# EasyEDA Pro project ProProject_Hauptplatine_ESP32.epro, schematic Arduino_fuer_LEDs_DCC_1.8.2

## Sheets
1 Arduino_fuer_LEDs_DCC_1.8.2_1
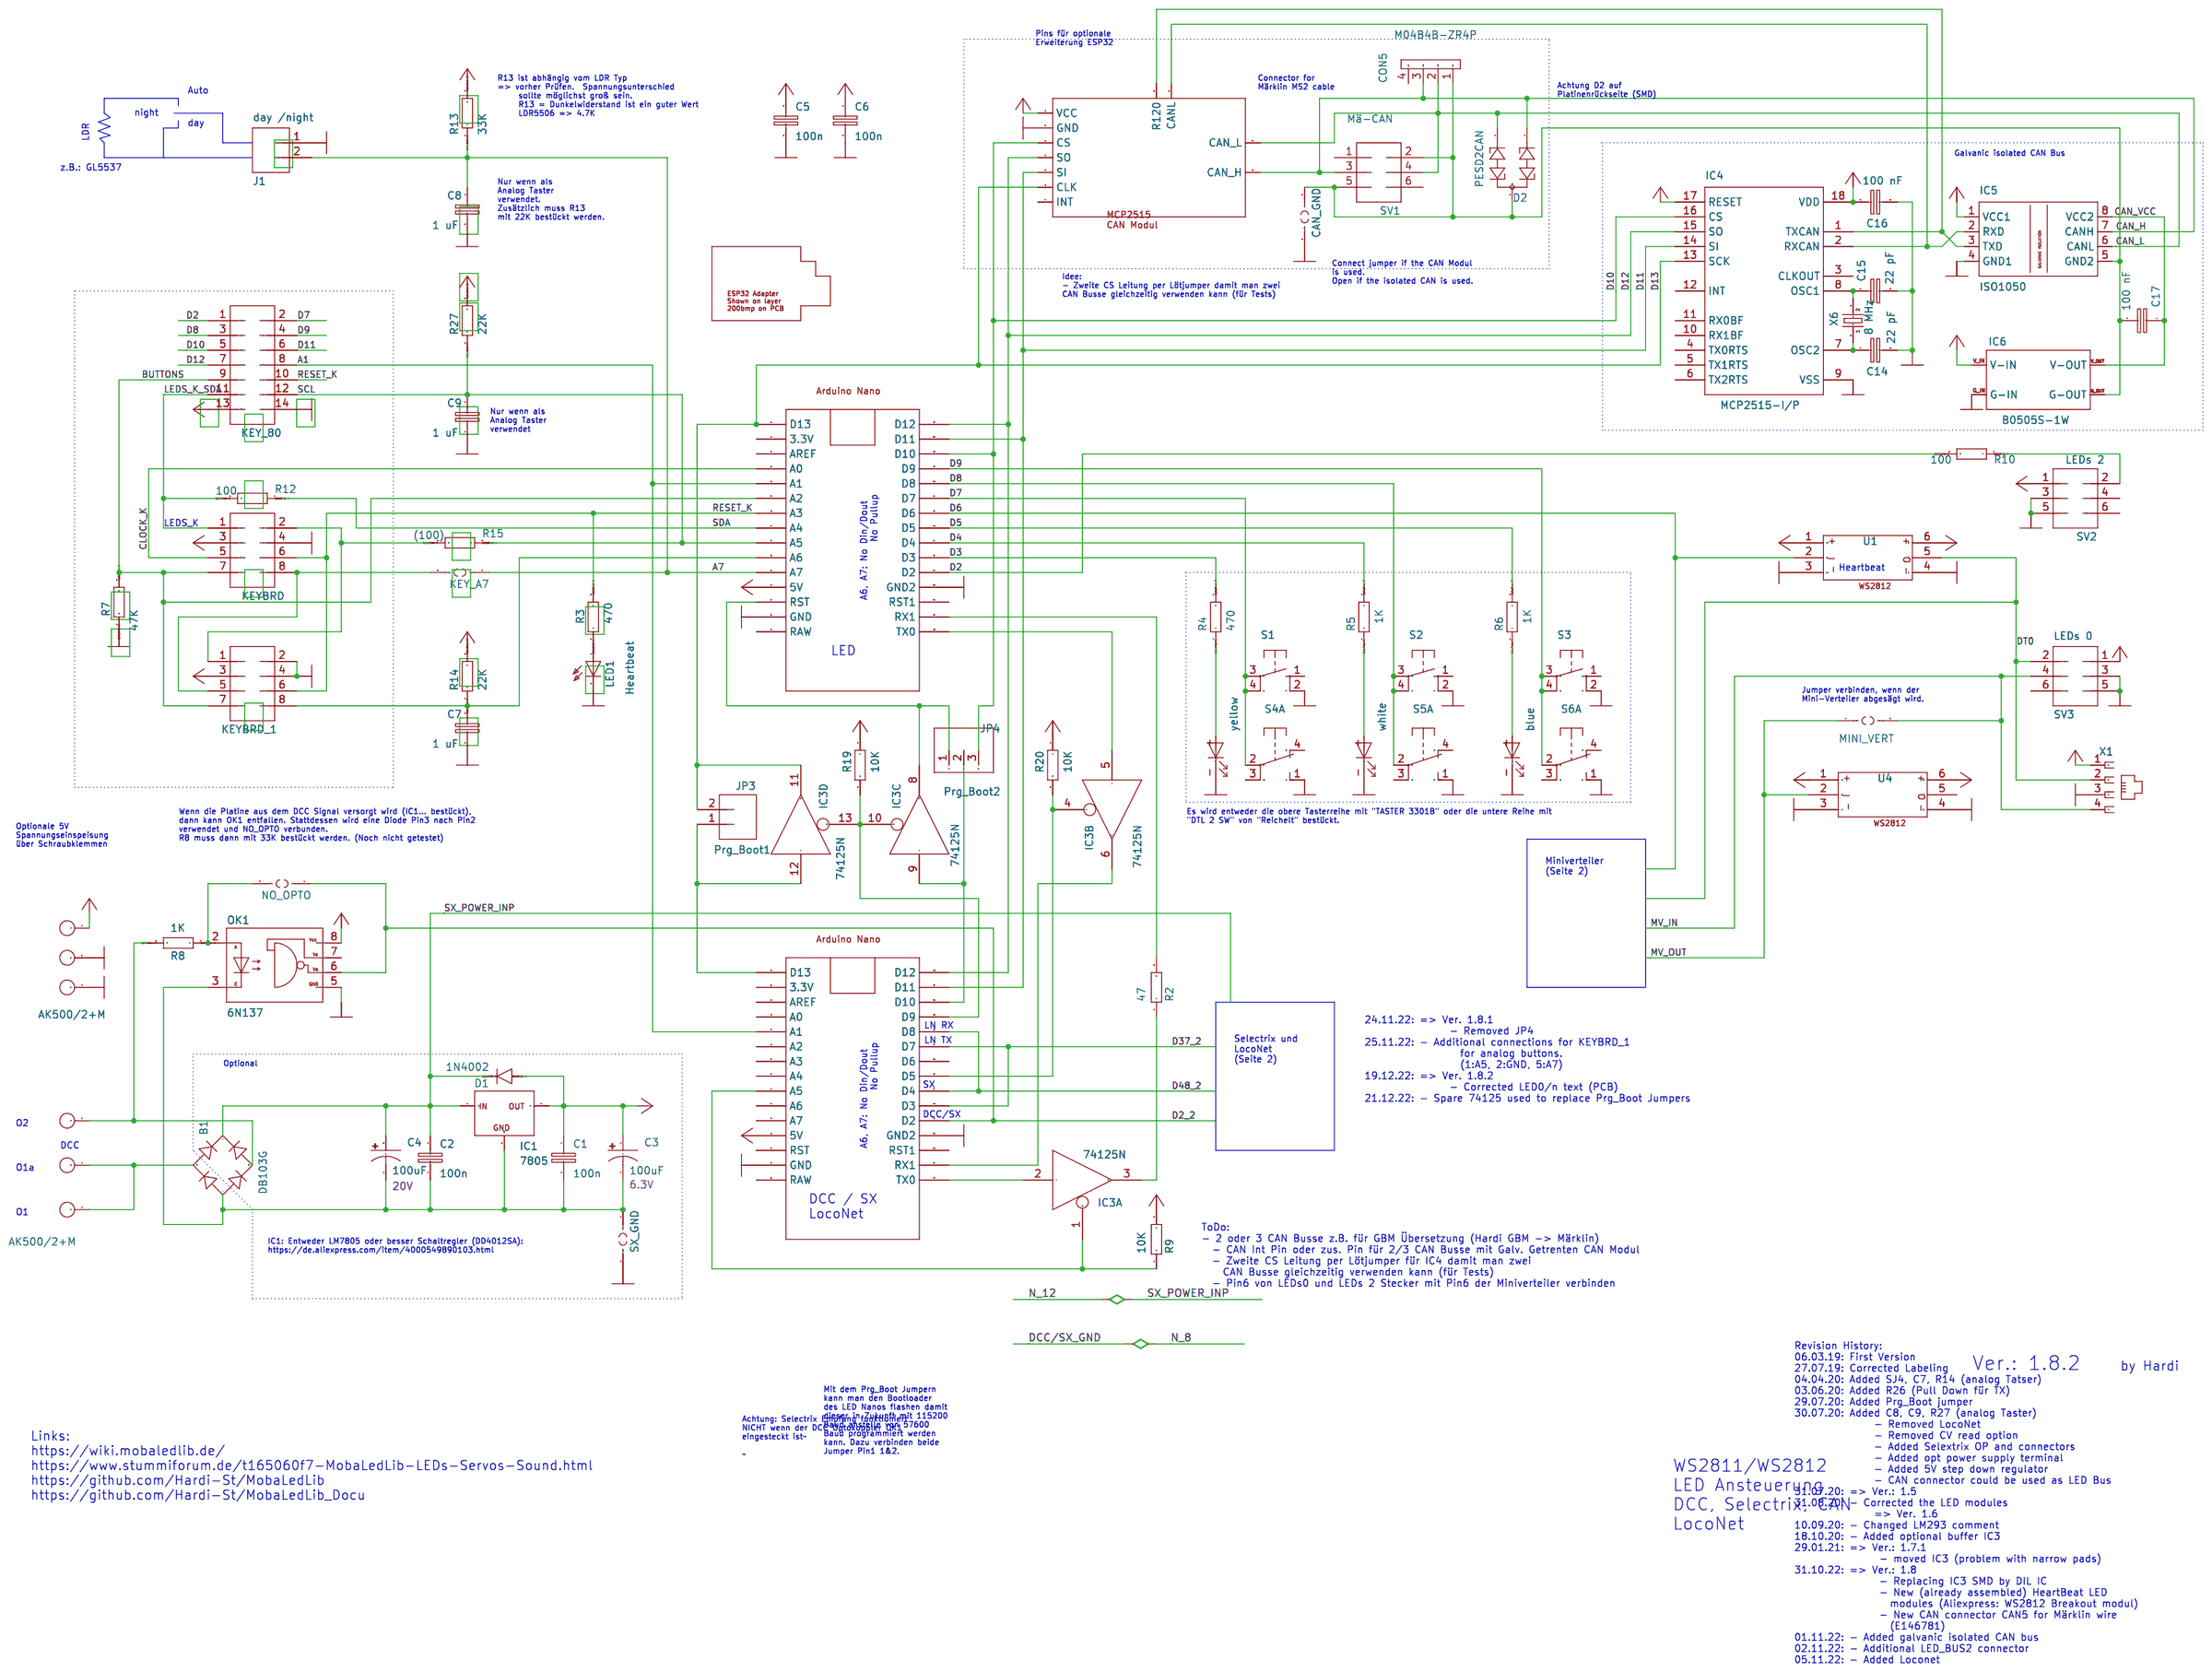
[diagram p3: Arduino_fuer_LEDs_DCC_1.8.2_1]
2 Arduino_fuer_LEDs_DCC_1.8.2_2
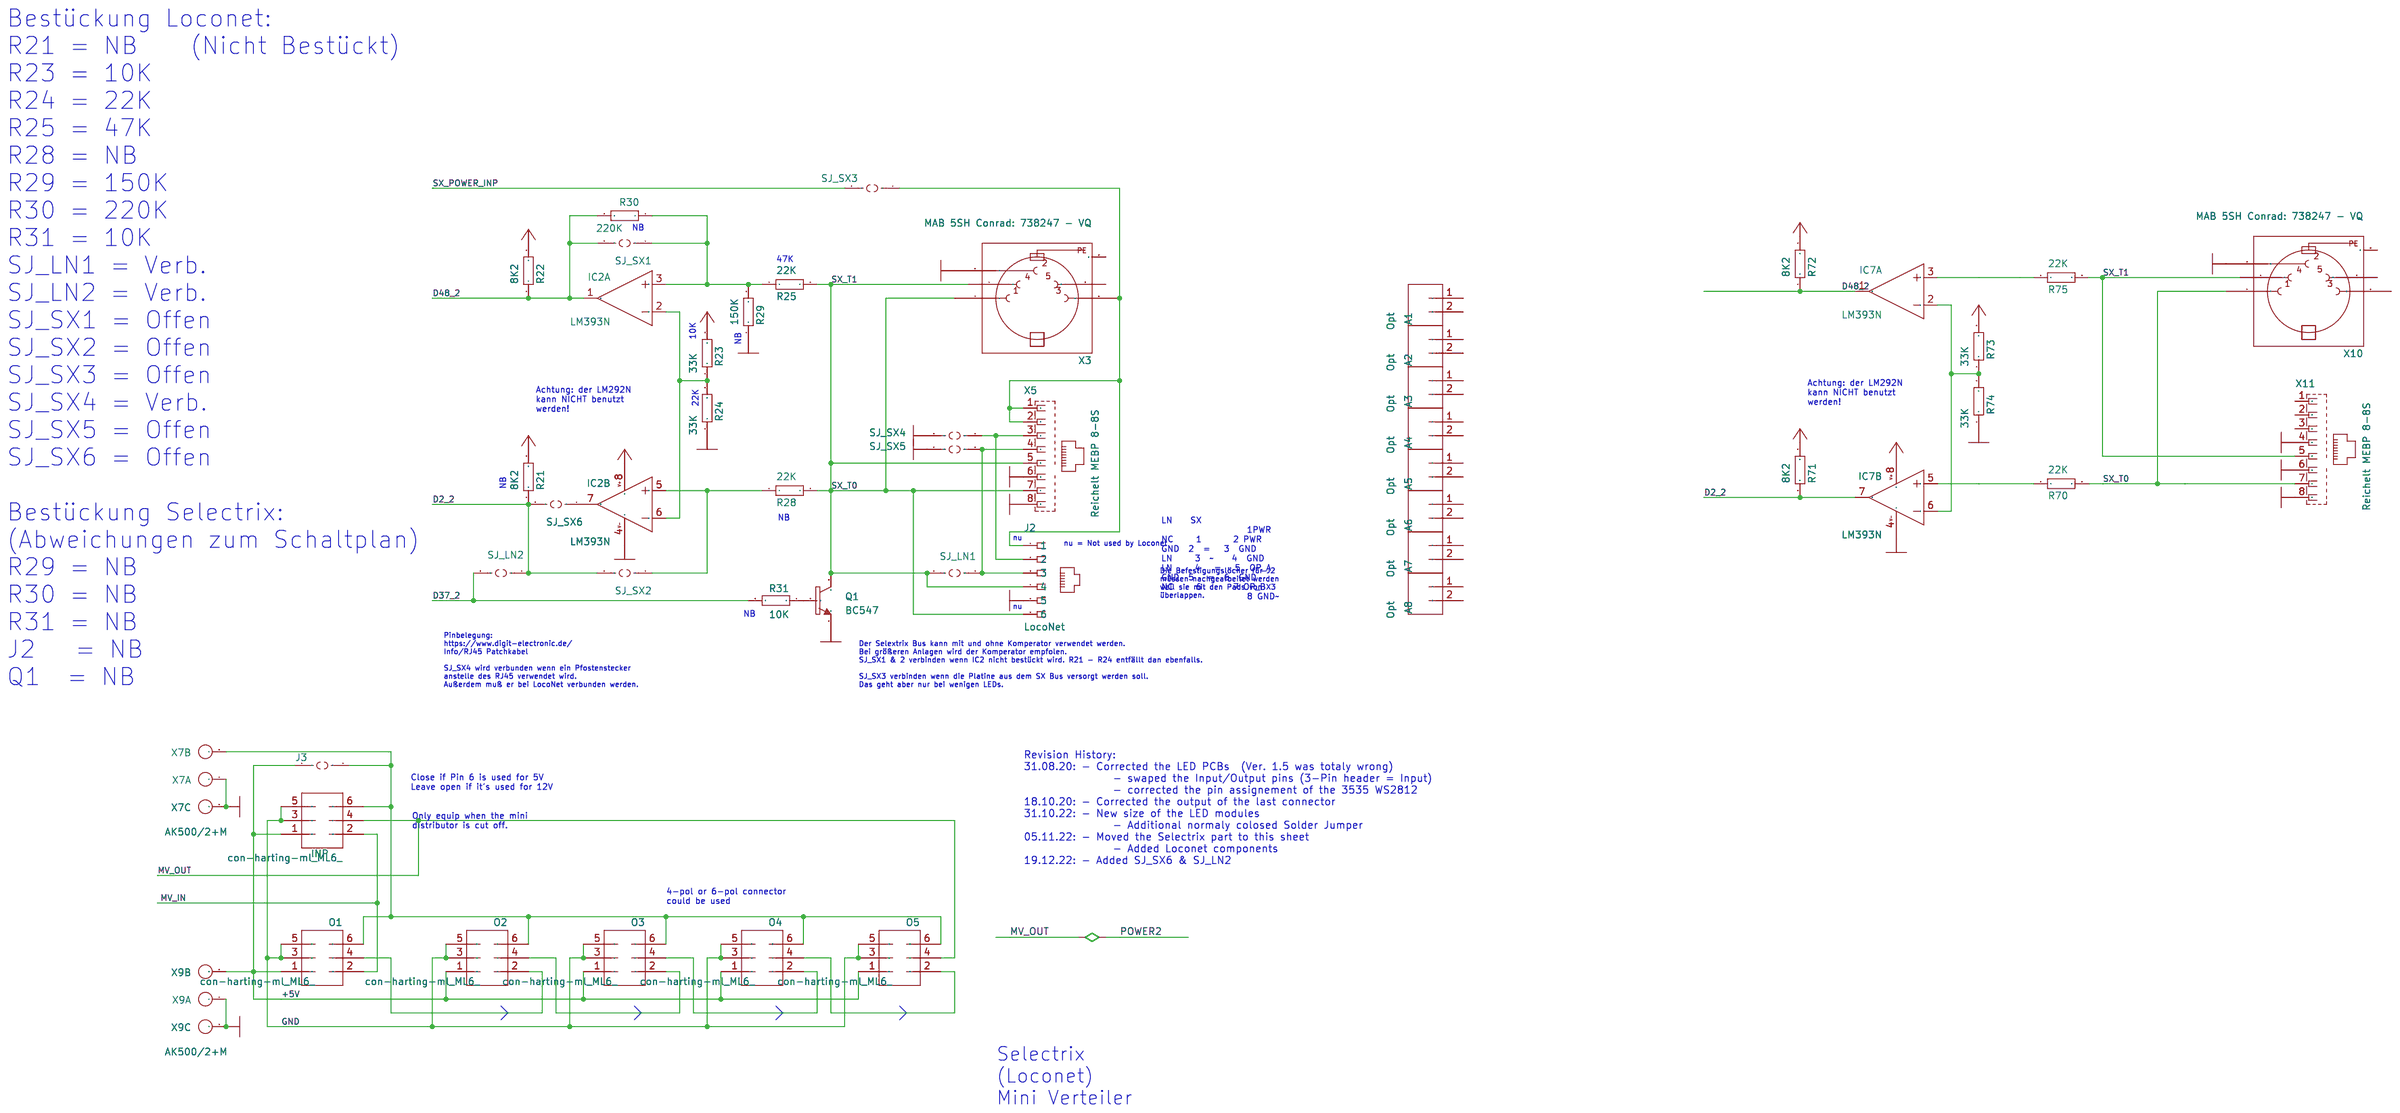
[diagram p4: Arduino_fuer_LEDs_DCC_1.8.2_2]

## Parts
sheet Arduino_fuer_LEDs_DCC_1.8.2_1
B1  DB103G
C1  100n
C2  100n
C3  100uF
C4  100uF
C5  100n
C6  100n
C7  1 uF
C8  1 uF
C9  1 uF
C14  22 pF
C15  22 pF
C16  100 nF
C17  100 nF
CAN2  MCP2515_CAN_MODUL
CAN_GND  SOLDERJUMPERNO
CON5  M04B4B-ZR4P
D1  1N4002
D2  PESD2CAN
IC1  7805
IC3  74125N  (sections A,B,C,D)
IC4  MCP2515-I/P
IC5  ISO1050
IC6  B0505S-1W
J1  day /night
JP3  Prg_Boot1
JP4  Prg_Boot2
KEY_80  ML14
KEY_A7  SOLDERJUMPERNO
KEYBRD  CON-HARTING-ML_ML08
KEYBRD_1  CON-HARTING-ML_ML08
LED1  Heartbeat
MINI_VERT  SOLDERJUMPERNO
NO_OPTO  SOLDERJUMPERNO
OK1  6N137
R2  47
R3  470
R4  470
R5  1K
R6  1K
R7  47K
R8  1K
R9  10K
R10  100
R12  100
R13  33K
R14  22K
R15  (100)
R19  10K
R20  10K
R27  22K
S1  10-XX
S2  10-XX
S3  10-XX
S4  yellow  (sections 1,D1)
S5  white  (sections 1,D1)
S6  blue  (sections 1,D1)
SV1  Mä-CAN
SV2  LEDs 2
SV3  LEDs 0
SX_GND  SOLDERJUMPERNO
U1  WS2812_BREAKOUT
U2  LED NANO
U3  DCC NANO
U4  WS2812_BREAKOUT
U$1  ESP_ADAPTER
X1  RJ10
X2  AK500/2+M  (sections G$1,G$2,G$3)
X4  AK500/2+M  (sections G$1,G$2,G$3)
X6  8 MHz
sheet Arduino_fuer_LEDs_DCC_1.8.2_2
A1  Opt
A2  Opt
A3  Opt
A4  Opt
A5  Opt
A6  Opt
A7  Opt
A8  Opt
IC2  LM393N  (sections A,B,P)
IC7  LM393N  (sections A,B,P)
INP  con-harting-ml_ML6_
J2  LocoNet
J3  SOLDERJUMPERNO
O1  con-harting-ml_ML6_
O2  con-harting-ml_ML6_
O3  con-harting-ml_ML6_
O4  con-harting-ml_ML6_
O5  con-harting-ml_ML6_
Q1  BC547
R21  8K2
R22  8K2
R23  33K
R24  33K
R25  22K
R28  22K
R29  150K
R30  220K
R31  10K
R70  22K
R71  8K2
R72  8K2
R73  33K
R74  33K
R75  22K
SJ_LN1  SOLDERJUMPERNO
SJ_LN2  SOLDERJUMPERNO
SJ_SX1  SOLDERJUMPERNO
SJ_SX2  SOLDERJUMPERNO
SJ_SX3  SOLDERJUMPERNO
SJ_SX4  SOLDERJUMPERNO
SJ_SX5  SOLDERJUMPERNO
SJ_SX6  SOLDERJUMPERNO
X3  MAB 5SH Conrad: 738247 - VQ
X5  Reichelt MEBP 8-8S
X7  AK500/2+M  (sections G$1,G$2,G$3)
X9  AK500/2+M  (sections G$1,G$2,G$3)
X10  MAB 5SH Conrad: 738247 - VQ
X11  Reichelt MEBP 8-8S

## Library data of the parts
B1 = Arduino_fuer_LEDs_DCC_2_DB?*G_DB10
C1 C2 C5-C9 = rcl_C-EU_025-025X050
C3 = Sound_MP3-TF-16P_and_WS2811_SPARKFUN-CAPACITORS_100UF-25V-20%(PTH)_: VOLTAGE: 6.3V
C4 = Sound_MP3-TF-16P_and_WS2811_SPARKFUN-CAPACITORS_100UF-25V-20%(PTH)_: VOLTAGE: 20V
C14-C17 = capacitor-wima_C_2.5/2
CAN2 = Arduino_fuer_LEDs_DCC_2_All_MCP2515_CAN_MODUL_
CAN_GND J3 KEY_A7 MINI_VERT NO_OPTO SJ_LN1 SJ_LN2 SJ_SX1-SJ_SX6 SX_GND = SparkFun-Retired_SOLDERJUMPER_NO
CON5 = Connectors_Inline3_7_M04_B4B-ZR4P
D1 = diode_1N4004_
D2 = diode_PESD1CAN_
IC1 = v-reg_78XXS_
IC3 = 74xx-us_74*125_N
IC4 = mcp2515_MCP2515_-I/P
IC5 = texas_ISO1050_
IC6 = MLL-Dominik-Hardi_DCDC_
A1-A8 J1 JP3 = SparkFun-Connectors_M02_PTH
JP4 = adafruit_PINHD-1X3_CB
KEY_80 = Arduino_fuer_LEDs_DCC_2_ML14_
KEYBRD KEYBRD_1 = PushButtonAction_4017_2_CON-HARTING-ML_ML08_
LED1 = Arduino_fuer_LEDs_DCC_2_LED_3MM
OK1 = Arduino_fuer_LEDs_DCC_2_6N137_
R2 R9 = rcl_R-EU__0204/7
R3-R8 R10 R12-R15 R27 = Arduino_fuer_LEDs_DCC_2_R_0204/7
R19-R25 R28-R31 R70-R75 = rcl_R-EU__0207/2V
S1-S3 = switch-omron_10-XX_
S4-S6 = switch-misc_SRKL_
SV1-SV3 = Arduino_fuer_LEDs_DCC_2_ML6_
U1 U4 = Arduino_fuer_LEDs_DCC_2_All_WS2812_BREAKOUT_
U2 U3 = Arduino_fuer_LEDs_DCC_2_NANO_
U$1 = ESP_Adapterplatine_Outline_ESP_ADAPTER_
X1 = RJ10_RJ10_
X2 X4 X7 X9 = Arduino_fuer_LEDs_DCC_2_AK500/2+M_
X6 = Discrete_CRYSTAL*_-HC49U-V
IC2 IC7 = linear_LM393_N
INP O1-O5 = con-harting-ml_ML6_
J2 = con-tycoelectronics_RJ11_NO_MOUNTING_HOLE
Q1 = transistor-npn_BC547*_
X3 X10 = con-hirschmann_MAB5SH_
X5 X11 = RJ45_Reichelt_RJ45_MEBP8-8S_

## Nets
+5V: C1.1 C3.1(+) C5.1 C6.1 C16.1 CAN2.1(VCC) D1.A IC1.OUT IC2.8(V+) IC4.17(RESET) IC4.18(VDD) IC5.1(VCC1) IC6.V_IN(V-IN) IC7.8(V+) INP.1 J3.1 KEY_80.13 KEYBRD.3 KEYBRD_1.3 O1.1 O2.1 O3.1 O4.1 O5.1 OK1.8(VCC) R9.2 R13.2 R14.2 R19.1 R20.1 R21.2 R22.2 R23.2 R27.2 R71.2 R72.2 R73.2 SV2.1 SV3.1 U1.1(VDD1) U1.6(VDD) U2.5V U3.5V U4.1(VDD1) U4.6(VDD) X1.1 X4.2(KL) X9.2(KL)
GND: C5.2 C6.2 C7.2 C8.2 C9.2 C14.2 C15.2 C16.2 CAN2.2(GND) CAN_GND.2 IC2.4(V-) IC4.9(VSS) IC5.4(GND1) IC6.G_IN(G-IN) IC7.4(V-) INP.3 INP.5 J1.1 J2.5 KEY_80.14 KEYBRD.4 KEYBRD_1.2 KEYBRD_1.4 LED1.K(C) O1.3 O1.5 O2.3 O2.5 O3.3 O3.5 O4.3 O4.5 O5.3 O5.5 OK1.5(GND) Q1.1(E) R7.1 R24.1 R29.1 R74.1 S1.2(S1) S2.2(S1) S3.2(S1) S4.1(S) S4.-(C) S5.1(S) S5.-(C) S6.1(S) S6.-(C) SJ_SX4.2 SJ_SX5.2 SV2.3 SV2.5 SV3.3 SV3.5 SX_GND.2 U1.3(GND1) U1.4(GND) U2.GND U2.GND1(GND2) U3.GND U3.GND1(GND2) U4.3(GND1) U4.4(GND) X1.3 X3.2 X4.1(KL) X4.M(KL) X5.6 X5.8 X7.1(KL) X7.M(KL) X9.1(KL) X9.M(KL) X10.2 X11.4 X11.6 X11.8
GND2: C17.2 CAN_GND.1 CON5.1 D2.3 IC5.5(GND2) IC6.G_OUT(G-OUT) SV1.2 SV1.5
A1: KEY_80.8 U2.A1 U3.A1
A7: C8.1 J1.2 KEY_A7.1 R13.1 U2.A7
BUTTONS: KEY_80.9 KEYBRD.7 KEYBRD_1.7 R7.2 U2.A2
CAN_H: CAN2.9(CAN_H) CON5.3 D2.1 IC5.7(CANH) SV1.3
CAN_L: CAN2.8(CAN_L) CON5.2 D2.2 IC5.6(CANL) SV1.4
CAN_VCC: C17.1 IC5.8(VCC2) IC6.V_OUT(V-OUT)
CLOCK_K: KEYBRD.5 U2.A0
D2: KEY_80.1 R10.2 U2.D2
D2_2: IC7.7(OUT) NO_OPTO.1 OK1.6(VO) R21.1 R71.1 SJ_LN2.1 SJ_SX2.2 SJ_SX6.2 U3.D2
D3: R4.2 U2.D3
D4: R5.2 U2.D4
D5: R6.2 U2.D5
D6: U1.2(DIN) U2.D6
D7: KEY_80.2 S1.3(P) S1.4(P1) S4.2(P) U2.D7
D8: KEY_80.3 S2.3(P) S2.4(P1) S5.2(P) U2.D8
D9: KEY_80.4 S3.3(P) S3.4(P1) S6.2(P) U2.D9
D10: CAN2.3(CS) IC4.16(CS) JP4.3 KEY_80.5 U2.D10
D11: CAN2.5(SI) IC4.14(SI) KEY_80.6 U2.D11 U3.D11
D12: CAN2.4(SO) IC4.15(SO) KEY_80.7 U2.D12 U3.D12
D13: CAN2.6(CLK) IC3.11(O) IC4.13(SCK) JP3.2 U2.D13
D37_2: R31.2 SJ_LN2.2 U3.D3 U3.D7
D48_2: IC2.1(OUT) IC7.1(OUT) R22.1 R30.2 R72.1 SJ_SX1.2 U3.D4 U3.D8
DCC/SX_GND: B1.- B1.AC1 C1.2 C2.2 C3.2(-) C4.2(-) IC1.GND OK1.3(C) SX_GND.1 X2.1(KL) X2.M(KL)
DT0: SV3.2 U1.5(DO) X1.2
LEDS_K_SDA: KEY_80.11 KEYBRD.1 R12.2
MV_IN: INP.2 MINI_VERT.2 O1.2 SV3.4 X1.4
MV_OUT: INP.4 MINI_VERT.1 O5.4 U4.2(DIN)
N_1: IC3.5(I) U2.TX0
N_2: J2.1 SJ_SX3.1 X3.3 X5.1 X5.2
N_3: IC3.1(OE) R9.1 U3.A5
N_4: R4.1 S4.+(A)
N_5: R10.1 SV2.2
N_6: R5.1 S5.+(A)
N_7: R6.1 S6.+(A)
N_9: J2.2 SJ_SX4.1 X5.3
N_10: IC2.7(OUT) SJ_SX6.1
N_11: IC3.10(OE) IC3.13(OE) R19.2 U3.D9
N_12: B1.+ B1.AC2 C2.1 C4.1(+) D1.C IC1.IN R8.2 SJ_SX3.2 X2.2(KL)
N_14: Q1.2(B) R31.1
N_15: IC3.8(O) JP4.1 U2.RST
N_16: IC3.4(OE) R20.2 U3.D5
N_18: IC3.6(O) U3.RX1
N_19: LED1.A R3.1
N_20: IC3.12(I) JP3.1 U3.D13
N_21: NO_OPTO.2 OK1.2(A) R8.1
N_22: O3.4 O4.2
N_24: KEYBRD.2 KEYBRD_1.1 R15.2
N_25: KEY_A7.2 KEYBRD.8 KEYBRD_1.5
N_27: C7.1 KEYBRD_1.8 R14.1 U2.A6
N_28: IC3.9(I) JP4.2 U3.D10
N_31: IC3.2(I) U3.TX0
N_33: IC3.3(O) R2.1
N_34: R2.2 U2.RX1
N_35: O1.4 O2.2
N_37: O4.4 O5.2
N_38: IC2.2(-IN) IC2.6(-IN) R23.1 R24.2
N_39: IC2.3(+IN) R25.1 R29.2 R30.1 SJ_SX1.1
N_40: J2.3 SJ_LN1.1 SJ_SX5.1 X5.4
N_42: IC2.5(+IN) R28.1 SJ_SX2.1
N_58: O2.4 O3.2
OSC1: C15.1 IC4.8(OSC1) X6.2
OSC2: C14.1 IC4.7(OSC2) X6.1
RESET_K: KEY_80.10 KEYBRD.6 KEYBRD_1.6 R3.2 U2.A3
RXCAN: CAN2.11(CANL) IC4.2(RXCAN) IC5.2(RXD)
SCL: C9.1 KEY_80.12 R15.1 R27.1 U2.A5
SDA: R12.1 U2.A4
SX_T0: J2.6 R28.2 R70.2 X3.1 X5.7 X10.1 X11.7
SX_T1: J2.4 Q1.3(C) R25.2 R75.2 SJ_LN1.2 X3.4 X5.5 X10.4 X11.5
TXCAN: CAN2.10(R120) IC4.1(TXCAN) IC5.3(TXD)
Net-(IC7-2): IC7.2(-IN) IC7.6(-IN) R73.1 R74.2
Net-(IC7-3): IC7.3(+IN) R75.1
Net-(IC7-5): IC7.5(+IN) R70.1
Net-(INP-6): INP.6 J3.2 O1.6 O2.6 O3.6 O4.6 O5.6 X7.2(KL)

Not connected (* = marked no-connect by the designer): A1 1 2; A2 1 2; A3 1 2; A4 1 2; A5 1 2; A6 1 2; A7 1 2; A8 1 2; CAN2 7(INT); CON5 4; IC4 3(CLKOUT) 4(TX0RTS) 5(TX1RTS) 6(TX2RTS) 10(RX1BF) 11(RX0BF) 12(INT); OK1 7(VE); S1 1(S); S2 1(S); S3 1(S); S4 3(P@1) 4(O); S5 3(P@1) 4(O); S6 3(P@1) 4(O); SV1 1 6; SV2 4 6; SV3 6; U2 3.3V AREF RAW RST1; U3 3.3V A0 A2 A3 A4 A6 A7 AREF D6 RAW RST RST1; U4 5(DO); X3 5 PE*2(PE); X10 3 5 PE*2(PE); X11 1 2 3

## Notes on the sheets
sheet 1
- Pins für optionale
  Erweiterung ESP32
- R13 ist abhängig vom LDR Typ
  => vorher Prüfen.  Spannungsunterschied
       sollte möglichst groß sein.
       R13 = Dunkelwiderstand ist ein guter Wert
       LDR5506 => 4.7K
- Connector for
  Märklin MS2 cable
- Achtung D2 auf
  Platinenrückseite (SMD)
- Auto
- night
- day
- ✓
- LDR
- Galvanic isolated CAN Bus
- z.B.: GL5537
- ✓
- Nur wenn als
  Analog Taster
  verwendet.
  Zusätzlich muss R13
  mit 22K bestückt werden.
- ✓
- Connect jumper if the CAN Modul
  is used.
  Open if the isolated CAN is used.
- Idee:
  - Zweite CS Leitung per Lötjumper damit man zwei
  CAN Busse gleichzeitig verwenden kann (für Tests)
- ✓
- ✓
- Nur wenn als
  Analog Taster
  verwendet
- ✓
- ✓
- ✓
- ✓
- ✓
- LEDS_K
- ✓
- Heartbeat
- ✓
- ✓
- A6, A7: No Din/Dout
              No Pullup
- ✓
- ✓
- LED
- ✓
- ✓
- ✓
- Jumper verbinden, wenn der
  Mini-Verteiler abgesägt wird.
- ✓
- ✓
- Wenn die Platine aus dem DCC Signal versorgt wird (IC1... bestückt),
  dann kann OK1 entfallen. Stattdessen wird eine Diode Pin3 nach Pin2
  verwendet und NO_OPTO verbunden.
  R8 muss dann mit 33K bestückt werden. (Noch nicht getestet)
- Es wird entweder die obere Tasterreihe mit "TASTER 3301B" oder die untere Reihe mit
  "DTL 2 SW" von "Reichelt" bestückt.
- Optionale 5V
  Spannungseinspeisung
  über Schraubklemmen
- Miniverteiler
  (Seite 2)
- LN RX
- 24.11.22: => Ver. 1.8.1
                  - Removed JP4
  25.11.22: - Additional connections for KEYBRD_1
                    for analog buttons.
                    (1:A5, 2:GND, 5:A7)
  19.12.22: => Ver. 1.8.2
                  - Corrected LED0/n text (PCB)
  21.12.22: - Spare 74125 used to replace Prg_Boot Jumpers
- LN TX
- Selectrix und
  LocoNet
  (Seite 2)
- Optional
- SX
- DCC/SX
- O2
- DCC
- A6, A7: No Din/Dout
              No Pullup
- O1a
- DCC / SX
  LocoNet
- O1
- ToDo:
  - 2 oder 3 CAN Busse z.B. für GBM Übersetzung (Hardi GBM -> Märklin)
    - CAN Int Pin oder zus. Pin für 2/3 CAN Busse mit Galv. Getrenten CAN Modul
    - Zweite CS Leitung per Lötjumper für IC4 damit man zwei
      CAN Busse gleichzeitig verwenden kann (für Tests)
    - Pin6 von LEDs0 und LEDs 2 Stecker mit Pin6 der Miniverteiler verbinden
- IC1: Entweder LM7805 oder besser Schaltregler (DD4012SA):
  https://de.aliexpress.com/item/4000549890103.html
- Revision History:
  06.03.19: First Version
  27.07.19: Corrected Labeling
  04.04.20: Added SJ4, C7, R14 (analog Tatser)
  03.06.20: Added R26 (Pull Down für TX)
  29.07.20: Added Prg_Boot jumper
  30.07.20: Added C8, C9, R27 (analog Taster)
                 - Removed LocoNet
                 - Removed CV read option
                 - Added Selextrix OP and connectors
                 - Added opt power supply terminal
                 - Added 5V step down regulator
                 - CAN connector could be used as LED Bus
  31.07.20: => Ver.: 1.5
  31.08.20: - Corrected the LED modules
                 => Ver. 1.6
  10.09.20: - Changed LM293 comment
  18.10.20: - Added optional buffer IC3
  29.01.21: => Ver.: 1.7.1
                  - moved IC3 (problem with narrow pads)
  31.10.22: => Ver.: 1.8
                  - Replacing IC3 SMD by DIL IC
                  - New (already assembled) HeartBeat LED
                    modules (Aliexpress: WS2812 Breakout modul)
                  - New CAN connector CAN5 for Märklin wire
                    (E146781)
  01.11.22: - Added galvanic isolated CAN bus
  02.11.22: - Additional LED_BUS2 connector
  05.11.22: - Added Loconet
- Ver.: 1.8.2
- by Hardi
- Mit dem Prg_Boot Jumpern
  kann man den Bootloader
  des LED Nanos flashen damit
  dieser in Zukunft mit 115200
  Baud anstelle von 57600
  Baud programmiert werden
  kann. Dazu verbinden beide
  Jumper Pin1 1&2.
- Achtung: Selectrix Empfang funktioniert
  NICHT wenn der DCC Optokoppler OK1
  eingesteckt ist~
  ~
- Links:
  https://wiki.mobaledlib.de/
  https://www.stummiforum.de/t165060f7-MobaLedLib-LEDs-Servos-Sound.html
  https://github.com/Hardi-St/MobaLedLib
  https://github.com/Hardi-St/MobaLedLib_Docu
- WS2811/WS2812
  LED Ansteuerung
  DCC, Selectrix, CAN
  LocoNet
sheet 2
- Bestückung Loconet:
  R21 = NB    (Nicht Bestückt)
  R23 = 10K
  R24 = 22K
  R25 = 47K
  R28 = NB
  R29 = 150K
  R30 = 220K
  R31 = 10K
  SJ_LN1 = Verb.
  SJ_LN2 = Verb.
  SJ_SX1 = Offen
  SJ_SX2 = Offen
  SJ_SX3 = Offen
  SJ_SX4 = Verb.
  SJ_SX5 = Offen
  SJ_SX6 = Offen
  Bestückung Selectrix:
  (Abweichungen zum Schaltplan)
  R29 = NB
  R30 = NB
  R31 = NB
  J2   = NB
  Q1  = NB
- NB
- 47K
- 10K
- NB
- Achtung: der LM292N
  kann NICHT benutzt
  werden!
- Achtung: der LM292N
  kann NICHT benutzt
  werden!
- 22K
- NB
- NB
- LN    SX
                     1PWR
  NC     1       2 PWR
  GND  2  =   3  GND
  LN     3  ~    4  GND
  LN     4   =   5  OP_A
  GND  5   =  6  GND
  NC     6       7 OP_B
                     8 GND~
- nu
- nu = Not used by Loconet
- Die Befestigungslöcher für J2
  müssen nachgearbeitet werden
  weil sie mit den Pads von X3
  überlappen.
- nu
- NB
- Pinbelegung:
  https://www.digit-electronic.de/
  Info/RJ45 Patchkabel
  SJ_SX4 wird verbunden wenn ein Pfostenstecker
  anstelle des RJ45 verwendet wird.
  Außerdem muß er bei LocoNet verbunden werden.
- Der Selextrix Bus kann mit und ohne Komperator verwendet werden.
  Bei größeren Anlagen wird der Komperator empfolen.
  SJ_SX1 & 2 verbinden wenn IC2 nicht bestückt wird. R21 - R24 entfällt dan ebenfalls.
  SJ_SX3 verbinden wenn die Platine aus dem SX Bus versorgt werden soll.
  Das geht aber nur bei wenigen LEDs.
- Revision History:
  31.08.20: - Corrected the LED PCBs  (Ver. 1.5 was totaly wrong)
                  - swaped the Input/Output pins (3-Pin header = Input)
                  - corrected the pin assignement of the 3535 WS2812
  18.10.20: - Corrected the output of the last connector
  31.10.22: - New size of the LED modules
                  - Additional normaly colosed Solder Jumper
  05.11.22: - Moved the Selectrix part to this sheet
                  - Added Loconet components
  19.12.22: - Added SJ_SX6 & SJ_LN2
- Close if Pin 6 is used for 5V
  Leave open if it's used for 12V
- Only equip when the mini
  distributor is cut off.
- 4-pol or 6-pol connector
  could be used
- Selectrix
  (Loconet)
  Mini Verteiler
